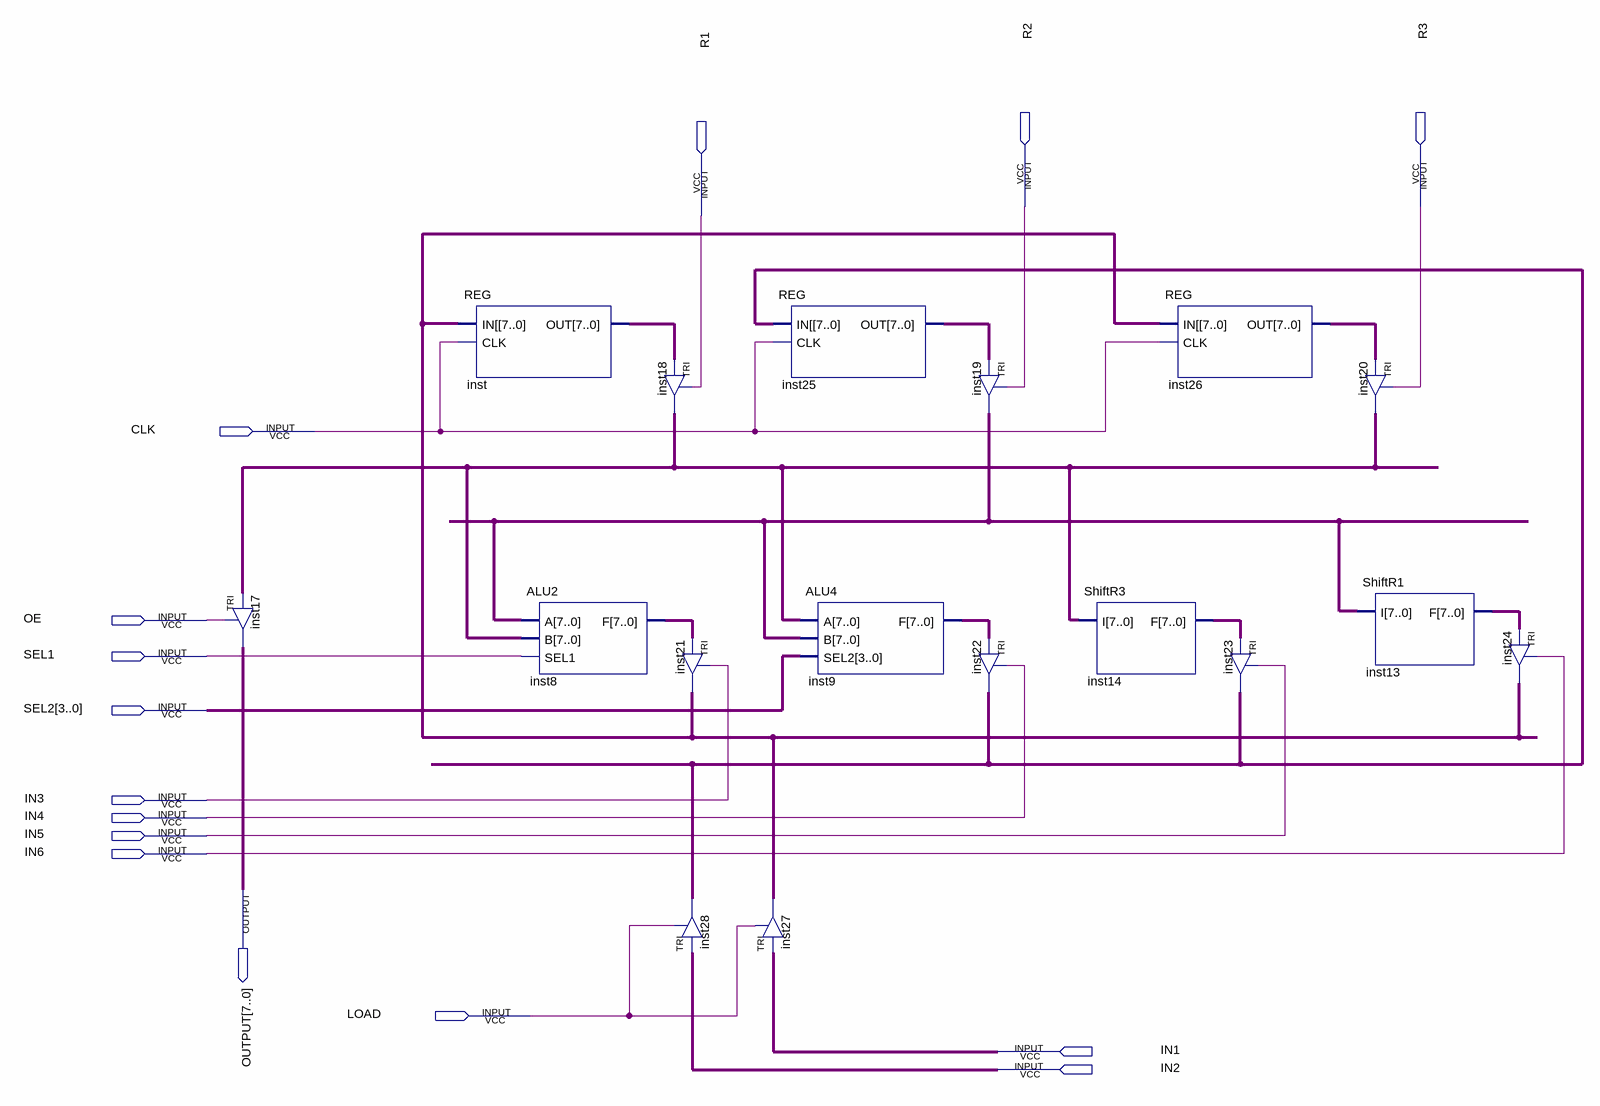
[diagram p0: schematic sheet]
// Quartus schematic Datapath.bdf as structural Verilog: 17 symbols, 15 pins
module Datapath (
  input  R2,
  input  R3,
  input  R1,
  input  CLK,
  input  OE,
  input  SEL1,
  input  [3:0] SEL2,
  input  IN3,
  input  IN4,
  input  IN5,
  input  IN6,
  input  LOAD,
  input  IN1,
  input  IN2,
  output [7:0] OUTPUT
);

  wire [7:0] inst8_f, inst9_f, inst13_f, inst14_f, inst18_out, inst19_out, inst21_out, inst25_out,
       inst26_out, inst28_out, inst_out, undriven, undriven_2;

  TRI inst17[7:0] (.IN(inst18_out), .OE(OE), .OUT(OUTPUT));
  REG inst (.\IN[ (inst21_out), .CLK(CLK), .OUT(inst_out));
  ALU2 inst8 (.A(inst19_out), .B(inst18_out), .SEL1(SEL1), .F(inst8_f));
  TRI inst18[7:0] (.IN(inst_out), .OE(R1), .OUT(inst18_out));
  TRI inst21[7:0] (.IN(inst8_f), .OE(IN3), .OUT(inst21_out));
  TRI inst28[7:0] (.IN(undriven_2), .OE(LOAD), .OUT(inst28_out));
  REG inst25 (.\IN[ (inst28_out), .CLK(CLK), .OUT(inst25_out));
  TRI inst27[7:0] (.IN(undriven), .OE(LOAD), .OUT(inst21_out));
  ALU4 inst9 (.A(inst18_out), .B(inst19_out), .SEL2(SEL2), .F(inst9_f));
  TRI inst19[7:0] (.IN(inst25_out), .OE(R2), .OUT(inst19_out));
  TRI inst22[7:0] (.IN(inst9_f), .OE(IN4), .OUT(inst28_out));
  ShiftR3 inst14 (.I(inst18_out), .F(inst14_f));
  REG inst26 (.\IN[ (inst21_out), .CLK(CLK), .OUT(inst26_out));
  TRI inst23[7:0] (.IN(inst14_f), .OE(IN5), .OUT(inst28_out));
  TRI inst20[7:0] (.IN(inst26_out), .OE(R3), .OUT(inst18_out));
  ShiftR1 inst13 (.I(inst19_out), .F(inst13_f));
  TRI inst24[7:0] (.IN(inst13_f), .OE(IN6), .OUT(inst21_out));
endmodule
